# EAGLE schematic BlueCore TM 3-Multuimedia_small (EAGLE 7.2.0)
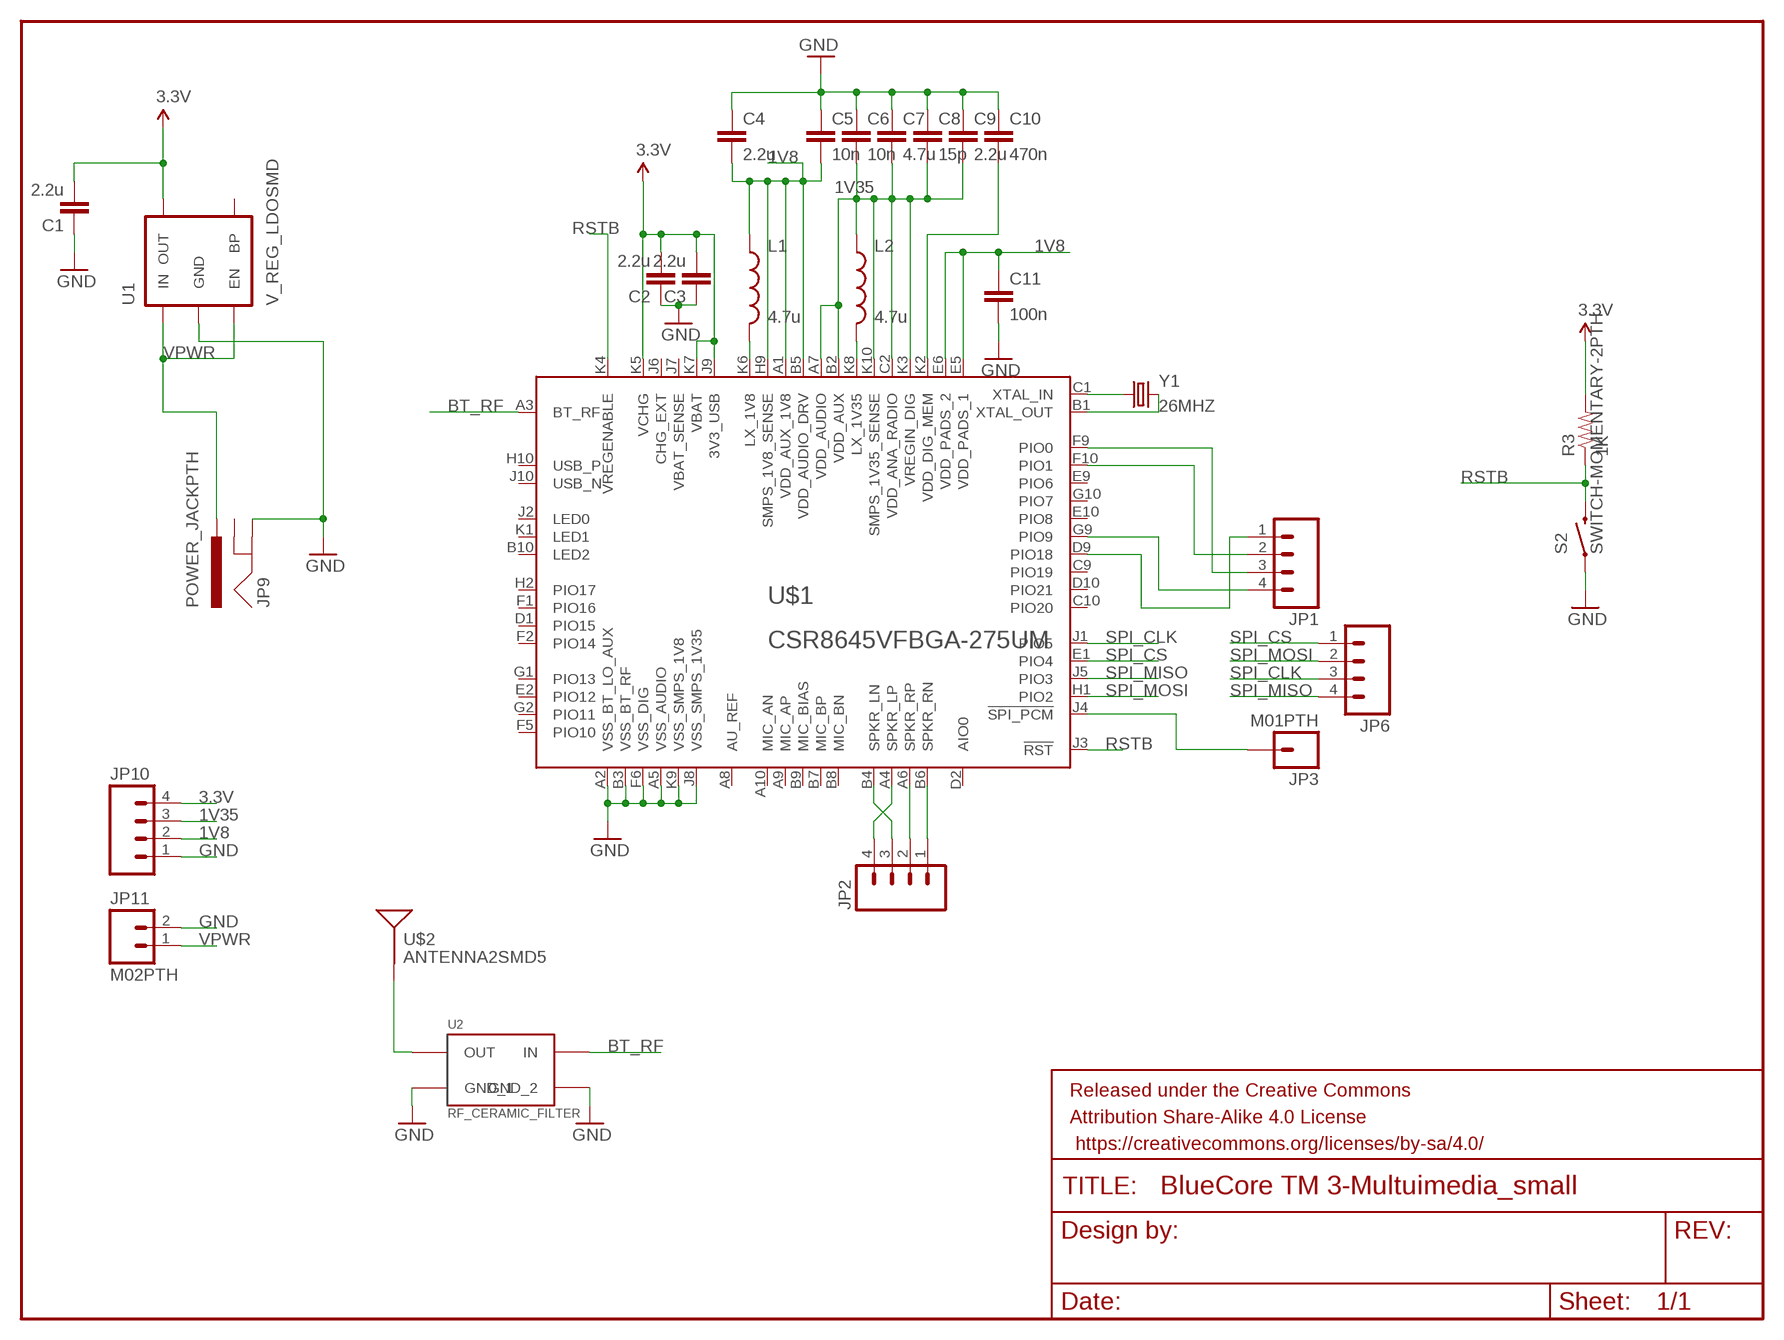
[diagram p0: schematic, sheet 1]

## Parts
C1  2.2u  CAPPTH  [CAP-PTH-SMALL]
C2  2.2u  CAPPTH  [CAP-PTH-SMALL]
C3  2.2u  CAPPTH  [CAP-PTH-SMALL]
C4  2.2u  CAPPTH  [CAP-PTH-SMALL]
C5  10n  CAPPTH  [CAP-PTH-SMALL]
C6  10n  CAPPTH  [CAP-PTH-SMALL]
C7  4.7u  CAPPTH  [CAP-PTH-SMALL]
C8  15p  CAPPTH  [CAP-PTH-SMALL]
C9  2.2u  CAPPTH  [CAP-PTH-SMALL]
C10  470n  CAPPTH  [CAP-PTH-SMALL]
C11  100n  CAPPTH  [CAP-PTH-SMALL]
FRAME1  FRAME-LETTER  [CREATIVE_COMMONS]
JP1  M04PTH  [1X04]
JP2  M04PTH  [1X04]
JP3  M01PTH  [1X01]
JP6  M04PTH  [1X04]
JP9  POWER_JACKPTH  [POWER_JACK_PTH]
JP10  M04PTH  [1X04]
JP11  M02PTH  [1X02]
L1  4.7u  INDUCTOR0805  [0805]
L2  4.7u  INDUCTOR0805  [0805]
R3  1K  RESISTOR0805-RES  [0805]
S2  SWITCH-MOMENTARY-2PTH  [TACTILE-PTH]
U1  V_REG_LDOSMD  [SOT23-5]
U2  RF_CERAMIC_FILTER  [RF_FILTER]
U$1  CSR8645VFBGA-275UM  [VFBGA68-LARGE]
U$2  ANTENNA2SMD5  [ANTENNA-CHIP5]
Y1  26MHZ  CRYSTALHC49US  [HC49US]

## Nets
1V8: C4.2 C5.2 C11.1 JP10.2 L1.1 U$1.A1(VDD_AUX_1V8) U$1.B5(VDD_AUDIO_DRV) U$1.E5(VDD_PADS_1) U$1.E6(VDD_PADS_2) U$1.H9(SMPS_1V8_SENSE)
1V35: C6.2 C7.2 C8.2 C9.2 JP10.3 L2.1 U$1.A7(VDD_AUDIO) U$1.B2(VDD_AUX) U$1.C2(VDD_ANA_RADIO) U$1.K3(VREGIN_DIG) U$1.K10(SMPS_1V35_SENSE)
3.3V: C1.2 C2.2 C3.2 JP10.4 R3.2 U1.5(OUT) U$1.J9(3V3_USB) U$1.K5(VCHG) U$1.K7(VBAT)
!SPI_PCM: JP3.1 U$1.J4(!SPI_PCM)
BT_RF: U2.4(IN) U$1.A3(BT_RF)
GND: C1.1 C2.1 C3.1 C4.1 C5.1 C6.1 C7.1 C8.1 C9.1 C10.1 C11.2 JP9.GND JP10.1 JP11.2 S2.1 U1.2(GND) U2.1(GND_1) U2.3(GND_2) U$1.A2(VSS_BT_LO_AUX) U$1.A5(VSS_AUDIO) U$1.B3(VSS_BT_RF) U$1.F6(VSS_DIG) U$1.J8(VSS_SMPS_1V35) U$1.K9(VSS_SMPS_1V8)
N$1: JP1.3 U$1.F9(PIO0)
N$2: JP2.3 U$1.B4(SPKR_LN)
N$3: L1.2 U$1.K6(LX_1V8)
N$4: L2.2 U$1.K8(LX_1V35)
N$5: U$1.C1(XTAL_IN) Y1.1
N$6: C10.2 U$1.K2(VDD_DIG_MEM)
N$7: U$1.B1(XTAL_OUT) Y1.2
N$8: JP1.2 U$1.F10(PIO1)
N$9: JP1.1 U$1.D9(PIO18)
N$10: JP2.4 U$1.A4(SPKR_LP)
N$11: JP1.4 U$1.G9(PIO9)
N$12: JP2.2 U$1.A6(SPKR_RP)
N$13: U2.2(OUT) U$2.FEED(SIGNAL)
N$14: JP2.1 U$1.B6(SPKR_RN)
RSTB: R3.1 S2.3 U$1.J3(!RST) U$1.K4(VREGENABLE)
SPI_CLK: JP6.3 U$1.J1(PIO5)
SPI_CS: JP6.1 U$1.E1(PIO4)
SPI_MISO: JP6.4 U$1.J5(PIO3)
SPI_MOSI: JP6.2 U$1.H1(PIO2)
VPWR: JP9.PWR JP11.1 U1.1(IN) U1.3(EN)
Unconnected: JP9.GNDBREAK U1.4(BP) U$1.A8(AU_REF) U$1.A9(MIC_AP) U$1.A10(MIC_AN) U$1.B7(MIC_BP) U$1.B8(MIC_BN) U$1.B9(MIC_BIAS) U$1.B10(LED2) U$1.C9(PIO19) U$1.C10(PIO20) U$1.D1(PIO15) U$1.D2(AIO0) U$1.D10(PIO21) U$1.E2(PIO12) U$1.E9(PIO6) U$1.E10(PIO8) U$1.F1(PIO16) U$1.F2(PIO14) U$1.F5(PIO10) U$1.G1(PIO13) U$1.G2(PIO11) U$1.G10(PIO7) U$1.H2(PIO17) U$1.H10(USB_P) U$1.J2(LED0) U$1.J6(CHG_EXT) U$1.J7(VBAT_SENSE) U$1.J10(USB_N) U$1.K1(LED1)

## Library data of the parts
C1-C11 = SparkFun-Passives:CAP: Capacitor Standard 0603 ceramic capacitor, and 0.1" leaded capacitor.
FRAME1 = SparkFun-Aesthetics:FRAME-LETTER: Schematic Frame Standard 8.5x11 US Letter frame
JP1 JP2 JP6 JP10 = SparkFun-Connectors:M04: Header 4 Standard 4-pin 0.1" header. Use with straight break away headers (SKU : PRT-00116), right angle break away headers (PRT-00553), swiss pins (PRT-00743), machine pins (PRT-00117), and female headers (PRT-00115). Molex polarized connector foot print use with SKU : PRT-08231 with associated crimp pins and housings. 1MM SMD Version SKU: PRT-10208
JP3 = SparkFun-Connectors:M01: Header 1 Standard 1-pin 0.1" header. Use with straight break away headers (SKU : PRT-00116), right angle break away headers (PRT-00553), swiss pins (PRT-00743), machine pins (PRT-00117), and female headers (PRT-00115).
JP9 = SparkFun-Connectors:POWER_JACK: Power Jack This is the standard 5.5mm barrel jack for power. The PTH is the most common, proven, reliable, footprint. The Slot footprint only works if the mill layer is transmitted to the PCB fab house so be warned. Mating wall wart : TOL-00298 (and others); PROD_ID: CONN-08197
JP11 = SparkFun-Connectors:M02: Standard 2-pin 0.1" header. Use with - straight break away headers ( PRT-00116) - right angle break away headers (PRT-00553) - swiss pins (PRT-00743) - machine pins (PRT-00117) - female headers (PRT-00115) Molex polarized connector foot print use with: PRT-08233 with associated crimp pins and housings. 2.54_SCREWTERM for use with PRT-10571. 3.5mm Screw Terminal footprints for PRT-08084 5mm Screw Terminal footprints for use with PRT-08432
L1 L2 = SparkFun-Passives:INDUCTOR: Inductors Basic Inductor/Choke - 0603 and 1206. Footprints are not proven and vary greatly between part numbers. SRN6045- 33uH, 20% 1.4A SDR0403-560KL - 56uH, 10%, 500mA RMS/740mA peak
R3 = SparkFun-Resistors:RESISTOR: Resistor Basic schematic elements and footprints for 0603, 1206, and PTH resistors.
S2 = SparkFun-Electromechanical:SWITCH-MOMENTARY-2: Various NO switches- pushbuttons, reed, etc
U1 = SparkFun-PowerIC:V_REG_LDO: Voltage Regulator LDO Standard 150mA LDO voltage regulator in SOT-23 layout. Micrel part MIC5205. BP (by-pass) pin is used to lower output noise with 470pF cap.
U2 = SparkFun-RF:RF_CERAMIC_FILTER
U$1 = SparkFun-DigitalIC:CSR8645
U$2 = SparkFun-RF:ANTENNA2: Chip antenna Single endded antenna. Common with smaller chip antennas. CHIP4 package is the GPS Chip Antenna SKU: GPS-08418. CHIP5 package is 2.4GHz chip antenna SKU: WRL-00144.
Y1 = SparkFun-FreqCtrl:CRYSTAL: Various standard crystals. Proven footprints.